# Altium schematic sheet OMODRI_ADC.SchDoc
size 431 x 279 mm; Date: Not shown in title block; ApprovedBy: Not shown in title block; CheckedBy: Not shown in title block; Author: Not shown in title block; CompanyName: Not shown in title block; DrawnBy: Cody Watkins; Engineer: Not shown in title block; Organization: Not shown in title block; Address1: Not shown in title block; Address2: Not shown in title block; Address3: Not shown in title block; Address4: Not shown in title block; DocumentNumber: 4; Revision: Use project parameter SCH_Rev; SheetNumber: 4; SheetTotal: 11; PageSetup: Record=PageOptions|CenterHorizontal=True|CenterVertical=True|PrintScale=1.00|XCorrection=1.00|YCorrection=1.00|PrintKind=0|BorderSize=5000000|LeftOffset=0|BottomOffset=0|Orientation=2|PaperLength=1000|PaperWidth=1000|Scale=100|PaperSource=15|PrintQuality=600|MediaType=1|DitherType=10|PaperKind=Letter|PrintScaleMode=1; CurrentTime: Not shown in title block; CurrentDate: Not shown in title block; Time: Not shown in title block; DocumentFullPathAndName: Not shown in title block; DocumentName: Not shown in title block; ModifiedDate: Not shown in title block; ImagePath: Not shown in title block
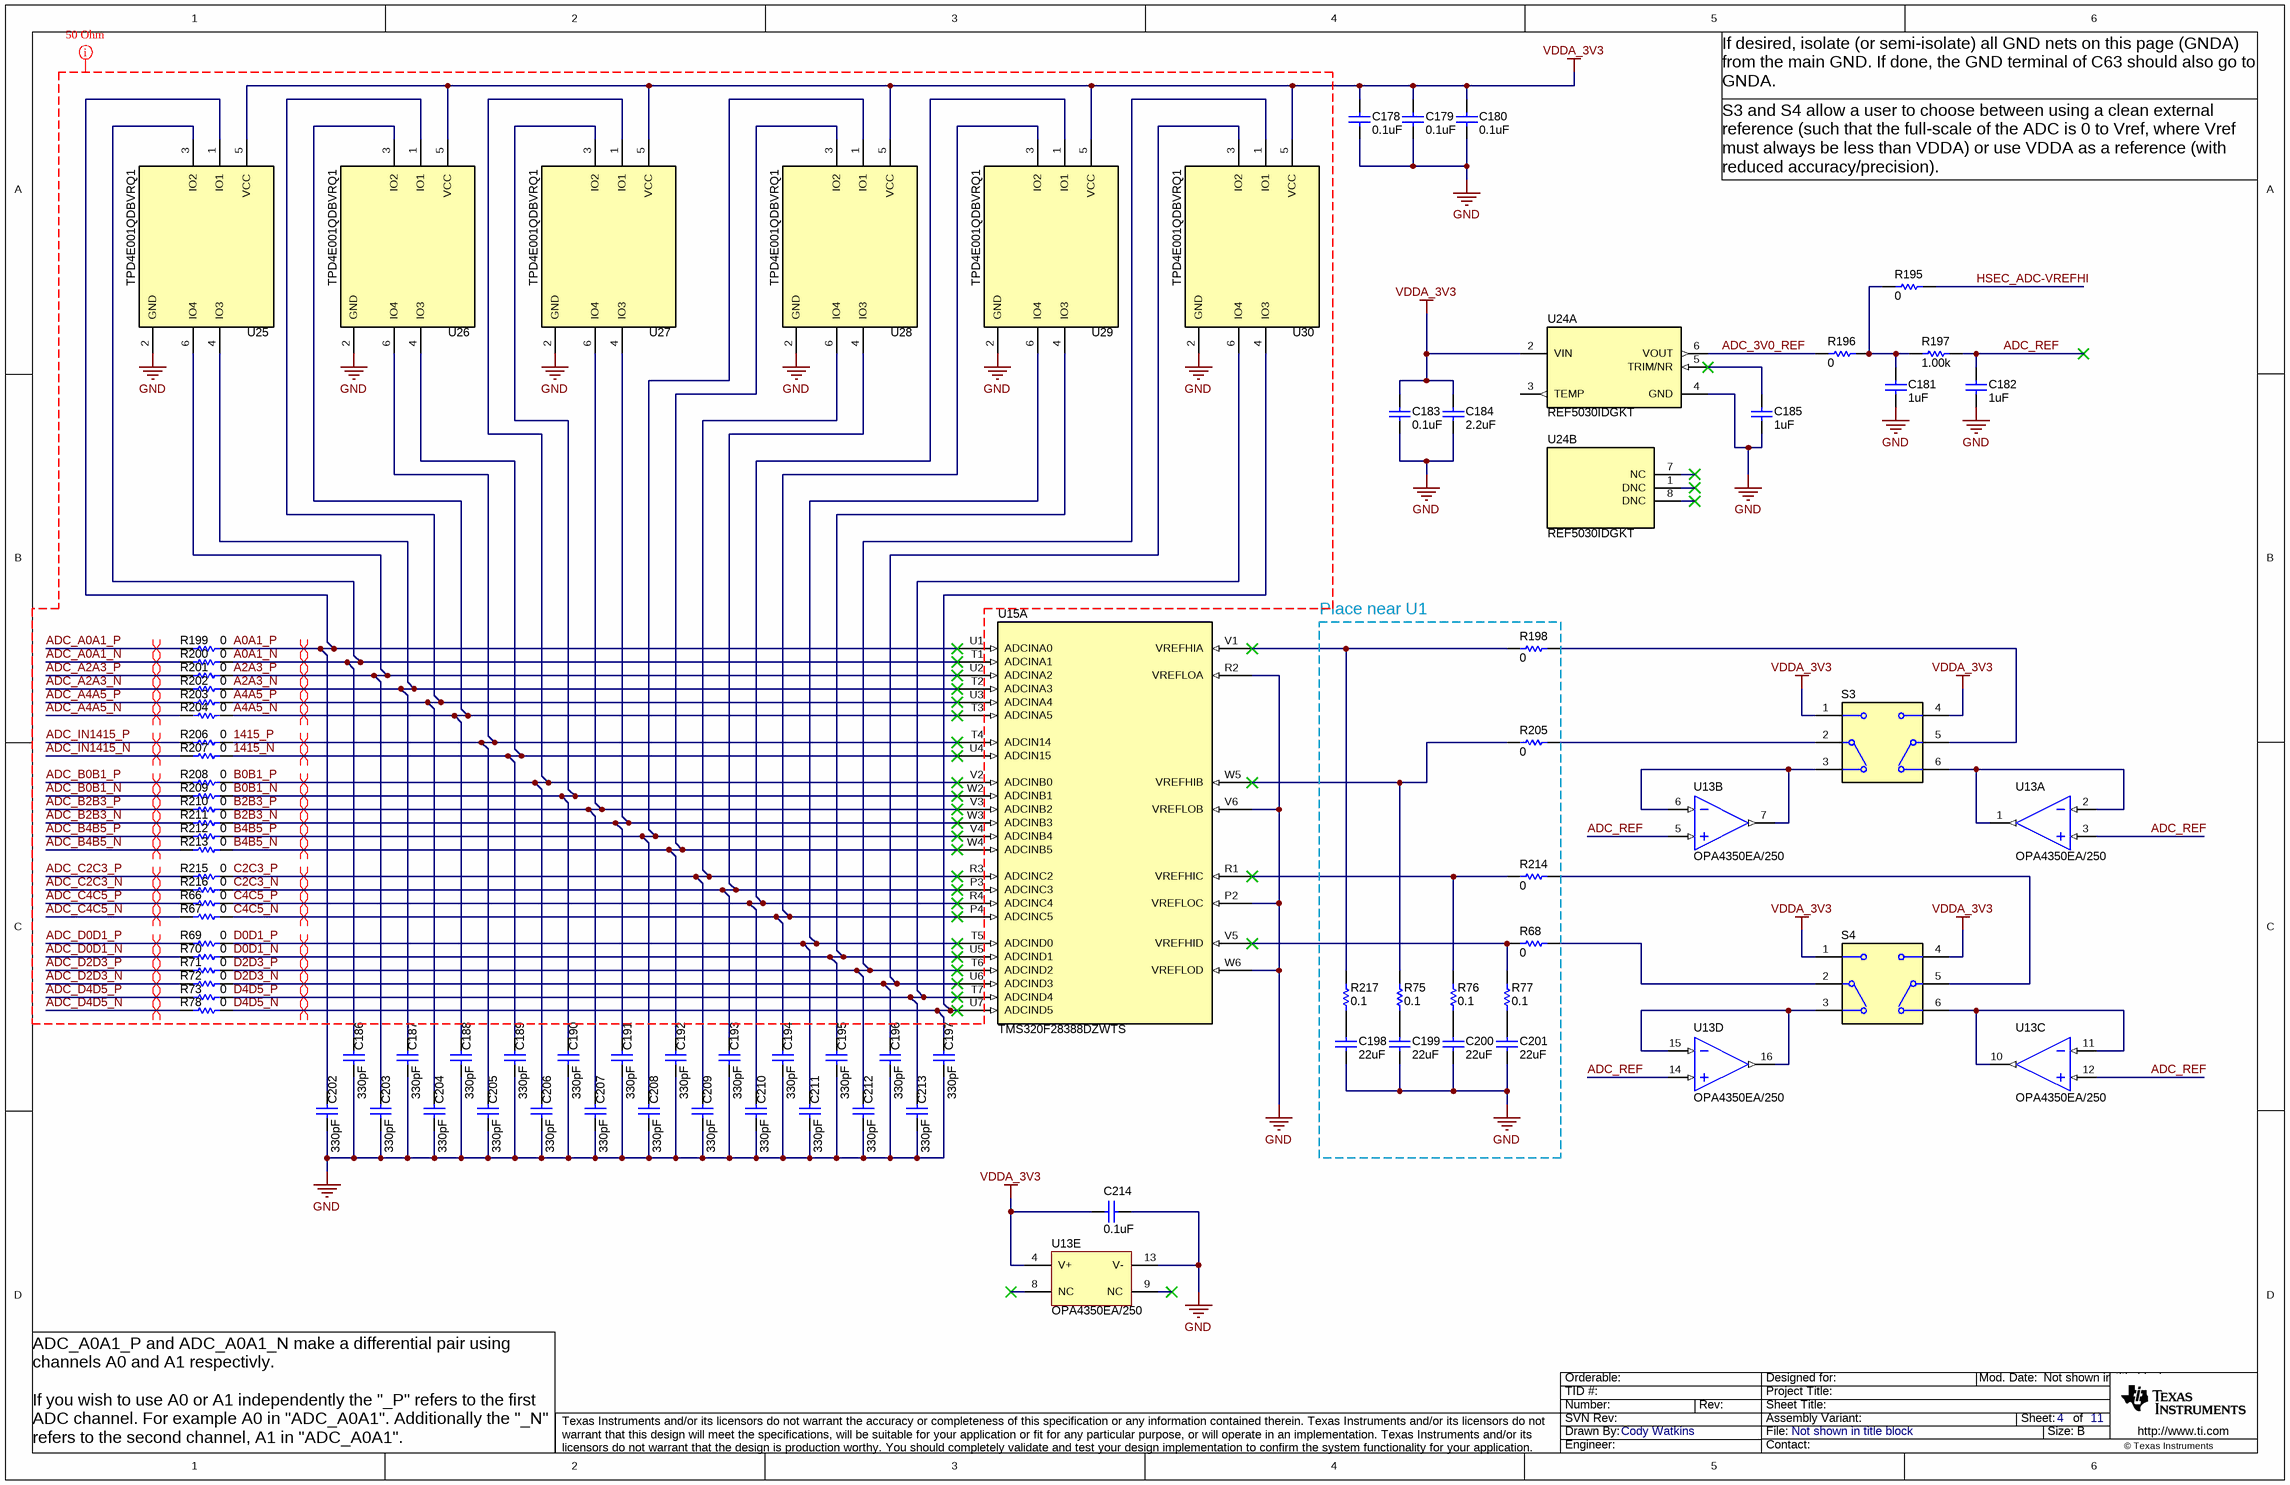
[diagram p0: OMODRI_ADC.SchDoc]

## Parts
C178  ValueDisplayed: 0.1uF  [0603]  (hidden comment: C0603C104K8RACTU)
C179  ValueDisplayed: 0.1uF  [0603]  (hidden comment: C0603C104K8RACTU)
C180  ValueDisplayed: 0.1uF  [0603]  (hidden comment: C0603C104K8RACTU)
C181  ValueDisplayed: 1uF  [0603]  (hidden comment: C0603C105Z9VACTU)
C182  ValueDisplayed: 1uF  [0603]  (hidden comment: C0603C105Z9VACTU)
C183  ValueDisplayed: 0.1uF  [0603]  (hidden comment: C0603C104K8RACTU)
C184  ValueDisplayed: 2.2uF  [0603]  (hidden comment: C0603C225K9PACTU)
C185  ValueDisplayed: 1uF  [0603]  (hidden comment: C0603C105Z9VACTU)
C186  ValueDisplayed: 330pF  [0603]  (hidden comment: C0603C331J5GACTU)
C187  ValueDisplayed: 330pF  [0603]  (hidden comment: C0603C331J5GACTU)
C188  ValueDisplayed: 330pF  [0603]  (hidden comment: C0603C331J5GACTU)
C189  ValueDisplayed: 330pF  [0603]  (hidden comment: C0603C331J5GACTU)
C190  ValueDisplayed: 330pF  [0603]  (hidden comment: C0603C331J5GACTU)
C191  ValueDisplayed: 330pF  [0603]  (hidden comment: C0603C331J5GACTU)
C192  ValueDisplayed: 330pF  [0603]  (hidden comment: C0603C331J5GACTU)
C193  ValueDisplayed: 330pF  [0603]  (hidden comment: C0603C331J5GACTU)
C194  ValueDisplayed: 330pF  [0603]  (hidden comment: C0603C331J5GACTU)
C195  ValueDisplayed: 330pF  [0603]  (hidden comment: C0603C331J5GACTU)
C196  ValueDisplayed: 330pF  [0603]  (hidden comment: C0603C331J5GACTU)
C197  ValueDisplayed: 330pF  [0603]  (hidden comment: C0603C331J5GACTU)
C198  ValueDisplayed: 22uF  [0603]  (hidden comment: GRM188R61A226ME15D)
C199  ValueDisplayed: 22uF  [0603]  (hidden comment: GRM188R61A226ME15D)
C200  ValueDisplayed: 22uF  [0603]  (hidden comment: GRM188R61A226ME15D)
C201  ValueDisplayed: 22uF  [0603]  (hidden comment: GRM188R61A226ME15D)
C202  ValueDisplayed: 330pF  [0603]  (hidden comment: C0603C331J5GACTU)
C203  ValueDisplayed: 330pF  [0603]  (hidden comment: C0603C331J5GACTU)
C204  ValueDisplayed: 330pF  [0603]  (hidden comment: C0603C331J5GACTU)
C205  ValueDisplayed: 330pF  [0603]  (hidden comment: C0603C331J5GACTU)
C206  ValueDisplayed: 330pF  [0603]  (hidden comment: C0603C331J5GACTU)
C207  ValueDisplayed: 330pF  [0603]  (hidden comment: C0603C331J5GACTU)
C208  ValueDisplayed: 330pF  [0603]  (hidden comment: C0603C331J5GACTU)
C209  ValueDisplayed: 330pF  [0603]  (hidden comment: C0603C331J5GACTU)
C210  ValueDisplayed: 330pF  [0603]  (hidden comment: C0603C331J5GACTU)
C211  ValueDisplayed: 330pF  [0603]  (hidden comment: C0603C331J5GACTU)
C212  ValueDisplayed: 330pF  [0603]  (hidden comment: C0603C331J5GACTU)
C213  ValueDisplayed: 330pF  [0603]  (hidden comment: C0603C331J5GACTU)
C214  ValueDisplayed: 0.1uF  [0603]  (hidden comment: C0603C104K8RACTU)
R66  ValueDisplayed: 0  [0603]  (hidden comment: CRCW06030000Z0EA)
R67  ValueDisplayed: 0  [0603]  (hidden comment: CRCW06030000Z0EA)
R68  ValueDisplayed: 0  [0603]  (hidden comment: CRCW06030000Z0EA)
R69  ValueDisplayed: 0  [0603]  (hidden comment: CRCW06030000Z0EA)
R70  ValueDisplayed: 0  [0603]  (hidden comment: CRCW06030000Z0EA)
R71  ValueDisplayed: 0  [0603]  (hidden comment: CRCW06030000Z0EA)
R72  ValueDisplayed: 0  [0603]  (hidden comment: CRCW06030000Z0EA)
R73  ValueDisplayed: 0  [0603]  (hidden comment: CRCW06030000Z0EA)
R75  ValueDisplayed: 0.1  [0402]  (hidden comment: ERJ2BWFR100X)
R76  ValueDisplayed: 0.1  [0402]  (hidden comment: ERJ2BWFR100X)
R77  ValueDisplayed: 0.1  [0402]  (hidden comment: ERJ2BWFR100X)
R78  ValueDisplayed: 0  [0603]  (hidden comment: CRCW06030000Z0EA)
R195  ValueDisplayed: 0  [0603]  (hidden comment: CRCW06030000Z0EA)
R196  ValueDisplayed: 0  [0603]  (hidden comment: CRCW06030000Z0EA)
R197  ValueDisplayed: 1.00k  [0603]  (hidden comment: RC0603FR-071KL)
R198  ValueDisplayed: 0  [0603]  (hidden comment: CRCW06030000Z0EA)
R199  ValueDisplayed: 0  [0603]  (hidden comment: CRCW06030000Z0EA)
R200  ValueDisplayed: 0  [0603]  (hidden comment: CRCW06030000Z0EA)
R201  ValueDisplayed: 0  [0603]  (hidden comment: CRCW06030000Z0EA)
R202  ValueDisplayed: 0  [0603]  (hidden comment: CRCW06030000Z0EA)
R203  ValueDisplayed: 0  [0603]  (hidden comment: CRCW06030000Z0EA)
R204  ValueDisplayed: 0  [0603]  (hidden comment: CRCW06030000Z0EA)
R205  ValueDisplayed: 0  [0603]  (hidden comment: CRCW06030000Z0EA)
R206  ValueDisplayed: 0  [0603]  (hidden comment: CRCW06030000Z0EA)
R207  ValueDisplayed: 0  [0603]  (hidden comment: CRCW06030000Z0EA)
R208  ValueDisplayed: 0  [0603]  (hidden comment: CRCW06030000Z0EA)
R209  ValueDisplayed: 0  [0603]  (hidden comment: CRCW06030000Z0EA)
R210  ValueDisplayed: 0  [0603]  (hidden comment: CRCW06030000Z0EA)
R211  ValueDisplayed: 0  [0603]  (hidden comment: CRCW06030000Z0EA)
R212  ValueDisplayed: 0  [0603]  (hidden comment: CRCW06030000Z0EA)
R213  ValueDisplayed: 0  [0603]  (hidden comment: CRCW06030000Z0EA)
R214  ValueDisplayed: 0  [0603]  (hidden comment: CRCW06030000Z0EA)
R215  ValueDisplayed: 0  [0603]  (hidden comment: CRCW06030000Z0EA)
R216  ValueDisplayed: 0  [0603]  (hidden comment: CRCW06030000Z0EA)
R217  ValueDisplayed: 0.1  [0402]  (hidden comment: ERJ2BWFR100X)
S3  CAS-D20TA  [SW_CAS-D20TA]  (value not drawn)
S4  CAS-D20TA  [SW_CAS-D20TA]  (value not drawn)
U13  OPA4350EA/250  [DBQ0016A_N]  (parts A,B,C,D,E of 5)
U15  TMS320F28388DZWTS  [ZWT0337A]  (part A of 5)
U24  REF5030IDGKT  [DGK0008A_N]  (parts A,B of 2)
U25  TPD4E001QDBVRQ1  [DBV0006A_N]
U26  TPD4E001QDBVRQ1  [DBV0006A_N]
U27  TPD4E001QDBVRQ1  [DBV0006A_N]
U28  TPD4E001QDBVRQ1  [DBV0006A_N]
U29  TPD4E001QDBVRQ1  [DBV0006A_N]
U30  TPD4E001QDBVRQ1  [DBV0006A_N]

## Nets
GND: C178.2 C179.2 C180.2 C181.2 C182.2 C183.2 C184.2 C185.2 C186.2 C187.2 C188.2 C189.2 C190.2 C191.2 C192.2 C193.2 C194.2 C195.2 C196.2 C197.2 C198.2 C199.2 C200.2 C201.2 C202.2 C203.2 C204.2 C205.2 C206.2 C207.2 C208.2 C209.2 C210.2 C211.2 C212.2 C213.2 C214.1 U13.13(V-) U15.P2(VREFLOC) U15.R2(VREFLOA) U15.V6(VREFLOB) U15.W6(VREFLOD) U24.4(GND) U25.2(GND) U26.2(GND) U27.2(GND) U28.2(GND) U29.2(GND) U30.2(GND)
VDDA_3V3: C178.1 C179.1 C180.1 C183.1 C184.1 C214.2 S3.1 S3.4 S4.1 S4.4 U13.4(V+) U24.2(VIN) U25.5(VCC) U26.5(VCC) U27.5(VCC) U28.5(VCC) U29.5(VCC) U30.5(VCC)
1415_N: C189.1 R207.1 U15.U4(ADCIN15) U26.4(IO3)
1415_P: C205.1 R206.1 U15.T4(ADCIN14) U26.6(IO4)
A0A1_N: C186.1 R200.1 U15.T1(ADCINA1) U25.3(IO2)
A0A1_P: C202.1 R199.1 U15.U1(ADCINA0) U25.1(IO1)
A2A3_N: C187.1 R202.1 U15.T2(ADCINA3) U25.4(IO3)
A2A3_P: C203.1 R201.1 U15.U2(ADCINA2) U25.6(IO4)
A4A5_N: C188.1 R204.1 U15.T3(ADCINA5) U26.3(IO2)
A4A5_P: C204.1 R203.1 U15.U3(ADCINA4) U26.1(IO1)
ADC_3V0_REF: R196.2 U24.6(VOUT)
ADC_A0A1_N: R200.2
ADC_A0A1_P: R199.2
ADC_A2A3_N: R202.2
ADC_A2A3_P: R201.2
ADC_A4A5_N: R204.2
ADC_A4A5_P: R203.2
ADC_B0B1_N: R209.2
ADC_B0B1_P: R208.2
ADC_B2B3_N: R211.2
ADC_B2B3_P: R210.2
ADC_B4B5_N: R213.2
ADC_B4B5_P: R212.2
ADC_C2C3_N: R216.2
ADC_C2C3_P: R215.2
ADC_C4C5_N: R67.2
ADC_C4C5_P: R66.2
ADC_D0D1_N: R70.2
ADC_D0D1_P: R69.2
ADC_D2D3_N: R72.2
ADC_D2D3_P: R71.2
ADC_D4D5_N: R78.2
ADC_D4D5_P: R73.2
ADC_IN1415_N: R207.2
ADC_IN1415_P: R206.2
ADC_REF: C182.1 R197.2 U13.3(IN_A+) U13.5(IN_B+) U13.12(IN_C+) U13.14(IN_D+)
B0B1_N: C190.1 R209.1 U15.W2(ADCINB1) U27.3(IO2)
B0B1_P: C206.1 R208.1 U15.V2(ADCINB0) U27.1(IO1)
B2B3_N: C191.1 R211.1 U15.W3(ADCINB3) U27.4(IO3)
B2B3_P: C207.1 R210.1 U15.V3(ADCINB2) U27.6(IO4)
B4B5_N: C192.1 R213.1 U15.W4(ADCINB5) U28.3(IO2)
B4B5_P: C208.1 R212.1 U15.V4(ADCINB4) U28.1(IO1)
C2C3_N: C193.1 R216.1 U15.P3(ADCINC3) U28.4(IO3)
C2C3_P: C209.1 R215.1 U15.R3(ADCINC2) U28.6(IO4)
C4C5_N: C194.1 R67.1 U15.P4(ADCINC5) U29.3(IO2)
C4C5_P: C210.1 R66.1 U15.R4(ADCINC4) U29.1(IO1)
D0D1_N: C195.1 R70.1 U15.U5(ADCIND1) U29.4(IO3)
D0D1_P: C211.1 R69.1 U15.T5(ADCIND0) U29.6(IO4)
D2D3_N: C196.1 R72.1 U15.U6(ADCIND3) U30.3(IO2)
D2D3_P: C212.1 R71.1 U15.T6(ADCIND2) U30.1(IO1)
D4D5_N: C197.1 R78.1 U15.U7(ADCIND5) U30.4(IO3)
D4D5_P: C213.1 R73.1 U15.T7(ADCIND4) U30.6(IO4)
HSEC_ADC-VREFHI: R195.1
NetC181_1: C181.1 R195.2 R196.1 R197.1
NetC185_1: C185.1 U24.5(TRIM/NR)
NetC198_1: C198.1 R217.2
NetC199_1: C199.1 R75.2
NetC200_1: C200.1 R76.2
NetC201_1: C201.1 R77.2
NetR68_1: R68.1 S4.2(C)
NetR68_2: R68.2 R77.1 U15.V5(VREFHID)
NetR75_1: R75.1 R205.2 U15.W5(VREFHIB)
NetR76_1: R76.1 R214.2 U15.R1(VREFHIC)
NetR198_1: R198.1 S3.5(C)
NetR198_2: R198.2 R217.1 U15.V1(VREFHIA)
NetR205_1: R205.1 S3.2(C)
NetR214_1: R214.1 S4.5(C)
NetS3_3: S3.3 U13.6(IN_B-) U13.7(OUT_B)
NetS3_6: S3.6 U13.1(OUT_A) U13.2(IN_A-)
NetS4_3: S4.3 U13.15(IN_D-) U13.16(OUT_D)
NetS4_6: S4.6 U13.10(OUT_C) U13.11(IN_C-)

Not connected (* = marked no-connect by the designer): U13 8(NC)* 9(NC)*; U24 1(DNC)* 3(TEMP) 7(NC)* 8(DNC)*

## Layout directives
differential pair: 1415_N, 1415_P, A0A1_N, A0A1_P, A2A3_N, A2A3_P, A4A5_N, A4A5_P, ADC_A0A1_N, ADC_A0A1_P, ADC_A2A3_N, ADC_A2A3_P, ADC_A4A5_N, ADC_A4A5_P, ADC_B0B1_N, ADC_B0B1_P, ADC_B2B3_N, ADC_B2B3_P, ADC_B4B5_N, ADC_B4B5_P, ADC_C2C3_N, ADC_C2C3_P, ADC_C4C5_N, ADC_C4C5_P, ADC_D0D1_N, ADC_D0D1_P, ADC_D2D3_N, ADC_D2D3_P, ADC_D4D5_N, ADC_D4D5_P, ADC_IN1415_N, ADC_IN1415_P, B0B1_N, B0B1_P, B2B3_N, B2B3_P, B4B5_N, B4B5_P, C2C3_N, C2C3_P, C4C5_N, C4C5_P, D0D1_N, D0D1_P, D2D3_N, D2D3_P, D4D5_N, D4D5_P
50 Ohm Impedance: Undefined: 1415_N, 1415_P, A0A1_N, A0A1_P, A2A3_N, A2A3_P, A4A5_N, A4A5_P, ADC_A0A1_N, ADC_A0A1_P, ADC_A2A3_N, ADC_A2A3_P, ADC_A4A5_N, ADC_A4A5_P, ADC_B0B1_N, ADC_B0B1_P, ADC_B2B3_N, ADC_B2B3_P, ADC_B4B5_N, ADC_B4B5_P, ADC_C2C3_N, ADC_C2C3_P, ADC_C4C5_N, ADC_C4C5_P, ADC_D0D1_N, ADC_D0D1_P, ADC_D2D3_N, ADC_D2D3_P, ADC_D4D5_N, ADC_D4D5_P, ADC_IN1415_N, ADC_IN1415_P, B0B1_N, B0B1_P, B2B3_N, B2B3_P, B4B5_N, B4B5_P, C2C3_N, C2C3_P, C4C5_N, C4C5_P, D0D1_N, D0D1_P, D2D3_N, D2D3_P, D4D5_N, D4D5_P, GND

## Notes on the sheet
- If desired, isolate (or semi-isolate) all GND nets on this page (GNDA) from the main GND. If done, the GND terminal of C63 should also go to GNDA.
- S3 and S4 allow a user to choose between using a clean external reference (such that the full-scale of the ADC is 0 to Vref, where Vref must always be less than VDDA) or use VDDA as a reference (with reduced accuracy/precision).
- Place near U1
- ADC_A0A1_P and ADC_A0A1_N make a differential pair using channels A0 and A1 respectivly.
  If you wish to use A0 or A1 independently the "_P" refers to the first ADC channel. For example A0 in "ADC_A0A1". Additionally the "_N" refers to the second channel, A1 in "ADC_A0A1".
- Drawn By:
- SVN Rev:
- Number:
- TID #:
- Orderable:
- Rev:
- Sheet Title:
- File:
- Project Title:
- Designed for:
- Assembly Variant:
- Mod. Date:
- Sheet:
- Size:
- of
- B
- http://www.ti.com
- Texas Instruments and/or its licensors do not warrant the accuracy or completeness of this specification or any information contained therein. Texas Instruments and/or its licensors do not warrant that this design will meet the specifications, will be suitable for your application or fit for any particular purpose, or will operate in an implementation. Texas Instruments and/or its licensors do not warrant that the design is production worthy. You should completely validate and test your design implementation to confirm the system functionality for your application.
- Engineer:
- Contact:
- © Texas Instruments

## Library data of the parts
C178-C180 C183 C214 = CMP-0006862-5: CAP, CERM, 0.1 uF, 10 V, +/- 10%, X7R, 0603; Manufacturer: Kemet; TaMin_C: -55°C; Polarized: N; SizeAreaWB_mm2: 4.68; Value1: Unknown; U/M: EA; Value: 0.1uF; TaMax_C: 125°C; SizeZ_mm: 1; SizeX_mm: 1.6; SizeY_mm: 0.8; Value2: 10V; SizeArea_mm2: 1.28; Cap_F: 100nF; AEC Category: Q200; Supplier Part Number 2: 80-C0603C104K8R; Publisher: Texas Instruments; Supplier 2: Mouser; Supplier Part Number 3: 1640032; TempCo: X7R; Supplier 3: Farnell; Published: 2008-06-19; RoHS: Y; MountType: SMT; Supplier 1: Digi-Key; PackageReference: 0603; Tolerance_%: 10%; Cap_Case: 0603; CompType: Capacitor; LatestRevisionDate: 2017-03-09; PartNumber: C0603C104K8RACTU; AEC Qualified: ?; ComponentLink1Description: Datasheet link; Supplier Part Number 1: 399-1095-1-ND; Technology: Ceramic; ComponentLink1URL: http://www.kemet.com/kemet/web/homepage/kechome.nsf/vapubfiles/F3102_Y5V.pdf/$file/F3102_Y5V.pdf
C181 C182 C185 = CMP-0006871-4: CAP, CERM, 1 uF, 6.3 V, +80/-20%, Y5V, 0603; Manufacturer: Kemet; TaMin_C: -30°C; Polarized: N; SizeAreaWB_mm2: 4.68; Value1: Unknown; U/M: EA; Value: 1uF; TaMax_C: 85°C; Tolerance_%: 80%; SizeZ_mm: 1; SizeX_mm: 1.6; SizeY_mm: 0.8; Value2: 6.3V; SizeArea_mm2: 1.28; Cap_F: 1µF; AEC Category: Q200; Supplier Part Number 2: 80-C0603C105Z9V; Publisher: Texas Instruments; Supplier 2: Mouser; Supplier Part Number 3: 1515067; TempCo: Y5V; Supplier 3: Farnell; Published: 2008-06-19; RoHS: Y; MountType: SMT; Supplier 1: Digi-Key; PackageReference: 0603; Cap_Case: 0603; CompType: Capacitor; LatestRevisionDate: 2017-03-09; PartNumber: C0603C105Z9VACTU; AEC Qualified: ?; ComponentLink1Description: Datasheet link; Supplier Part Number 1: 399-3217-1-ND; Technology: Ceramic; ComponentLink1URL: http://www.kemet.com/kemet/web/homepage/kechome.nsf/vapubfiles/F3102_Y5V.pdf/$file/F3102_Y5V.pdf
C184 = CMP-0006907-5: CAP, CERM, 2.2 uF, 6.3 V, +/- 10%, X5R, 0603; Manufacturer: Kemet; TaMin_C: -55°C; Polarized: N; SizeAreaWB_mm2: 4.68; Value1: Unknown; U/M: EA; Value: 2.2uF; TaMax_C: 85°C; SizeZ_mm: 1; SizeX_mm: 1.6; SizeY_mm: 0.8; Value2: 6.3V; SizeArea_mm2: 1.28; Cap_F: 2.2µF; AEC Category: Q200; Supplier Part Number 2: 80-C0603C225K9P; Publisher: Texas Instruments; Supplier 2: Mouser; Supplier Part Number 3: 1288257; TempCo: X5R; Supplier 3: Farnell; Published: 2008-06-19; RoHS: Y; MountType: SMT; Supplier 1: Digi-Key; PackageReference: 0603; Tolerance_%: 10%; Cap_Case: 0603; CompType: Capacitor; LatestRevisionDate: 2017-03-09; PartNumber: C0603C225K9PACTU; AEC Qualified: ?; ComponentLink1Description: Datasheet link; Supplier Part Number 1: 399-3362-1-ND; Technology: Ceramic; ComponentLink1URL: http://www.kemet.com/kemet/web/homepage/kechome.nsf/vapubfiles/F3102_Y5V.pdf/$file/F3102_Y5V.pdf
C186-C197 C202-C213 = CMP-0006920-4: CAP, CERM, 330 pF, 50 V, +/- 5%, C0G/NP0, 0603; Manufacturer: Kemet; TaMin_C: -55°C; Polarized: N; SizeAreaWB_mm2: 4.68; Value1: Unknown; U/M: EA; Value: 330pF; TaMax_C: 125°C; SizeZ_mm: 1; SizeX_mm: 1.6; SizeY_mm: 0.8; Value2: 50V; SizeArea_mm2: 1.28; AEC Category: Q200; Supplier Part Number 2: 80-C0603C331J5G; Publisher: Texas Instruments; Supplier 2: Mouser; Supplier Part Number 3: 1414634; TempCo: C0G/NP0; Supplier 3: Farnell; Published: 2008-06-19; RoHS: Y; MountType: SMT; Supplier 1: Digi-Key; PackageReference: 0603; Tolerance_%: 5%; Cap_Case: 0603; CompType: Capacitor; LatestRevisionDate: 2017-03-09; PartNumber: C0603C331J5GACTU; AEC Qualified: ?; Cap_F: 330pF; ComponentLink1Description: Datasheet link; Supplier Part Number 1: 399-1068-1-ND; Technology: Ceramic; ComponentLink1URL: http://www.kemet.com/kemet/web/homepage/kechome.nsf/vapubfiles/F3102_Y5V.pdf/$file/F3102_Y5V.pdf
C198-C201 = CMP-0007324-5: CAP, CERM, 22 uF, 10 V, +/- 20%, X5R, 0603; Manufacturer: MuRata; TaMin_C: -55°C; Polarized: N; SizeAreaWB_mm2: 4.68; Value1: Unknown; U/M: EA; Value: 22uF; TaMax_C: 85°C; SizeZ_mm: 1; SizeX_mm: 1.6; SizeY_mm: 0.8; Value2: 10V; SizeArea_mm2: 1.28; Cap_F: 22µF; AEC Category: Q200; Supplier Part Number 2: 68X2786; Publisher: Texas Instruments; Supplier 2: Newark; Supplier Part Number 3: 81-GRM188R61A226ME5D; TempCo: X5R; Supplier 3: Mouser; Published: 2008-06-19; RoHS: Y; MountType: SMT; Supplier 1: Digi-Key; PackageReference: 0603; Tolerance_%: 20%; Cap_Case: 0603; CompType: Capacitor; LatestRevisionDate: 2017-03-09; PartNumber: GRM188R61A226ME15D; AEC Qualified: ?; ComponentLink1Description: Datasheet link; Supplier Part Number 1: 490-10476-1-ND; Technology: Ceramic; ComponentLink1URL: http://psearch.murata.com/capacitor/product/GRM188R61A226ME15%23.pdf
R66-R73 R78 R195 R196 R198-R216 = CMP-0025697-4: RES, 0, 5%, 0.1 W, AEC-Q200 Grade 0, 0603; Manufacturer: Vishay-Dale; Value: 0; Value_Code: 0000; Power_W: 100mW; Value2: 0.1W; VDC_V: 75V; TempCo: 200 ppm/C; EIA_Code: E24; AEC Category: Q200; AEC Qualified: Y; SizeArea_mm2: 1.28; SizeX_mm: 1.6; SizeY_mm: 0.8; SizeZ_mm: 1; CompType: Resistor; PartNumber: CRCW06030000Z0EA; PackageReference: 0603; RoHS: E; Res_ohm: 0; Tolerance_%: 5%; Value1: 5%; MountType: SMT; Technology: Thick Film; ComponentLink1Description: Datasheet link; ComponentLink1URL: http://www.vishay.com/docs/20035/dcrcwe3.pdf; Supplier 1: Digi-Key; Supplier Part Number 1: 541-0.0GCT-ND; Supplier 2: Newark; Supplier Part Number 2: 52K8014; Supplier 3: Mouser; Supplier Part Number 3: 71-CRCW0603-0-E3; AEC Grade: 0
R75-R77 R217 = CMP-0078660-1: RES, 0.1, 1%, 0.25 W, 0402; Manufacturer: Panasonic; Power_W: 250mW; TempCo: 300 ppm/C; Value_Code: R100; Value: 0.1; EIA_Code: E96; Res_ohm: 1d; SizeX_mm: 1; SizeY_mm: 0.5; SizeZ_mm: 0.6; Value2: 0.25W; AEC Qualified: N; AEC Category: Q200; ComponentLink1URL: https://industrial.panasonic.com/cdbs/www-data/pdf/RDN0000/AOA0000C313.pdf; Supplier Part Number 2: 667-ERJ-2BWFR100X; Supplier 2: Mouser; RoHS: Y; Value1: 1%; MountType: SMT; Supplier 1: Digi-Key; PackageReference: 0402; Tolerance_%: 1%; SizeArea_mm2: 0.5; CompType: Resistor; PartNumber: ERJ2BWFR100X; ComponentLink1Description: Datasheet link; AEC Grade: N/A; Supplier Part Number 1: P17368CT-ND; Technology: Thick Film
R197 = CMP-0022895-5: RES, 1.00 k, 1%, 0.1 W, 0603; Manufacturer: Yageo; Power_W: 100mW; TempCo: 100 ppm/C; Value_Code: 1k00; Value: 1.00k; EIA_Code: E96; Res_ohm: 1k; SizeX_mm: 1.6; SizeY_mm: 0.8; SizeZ_mm: 1; Value2: 0.1W; SizeArea_mm2: 1.28; AEC Qualified: N; VDC_V: 75V; AEC Category: Q200; SizeAreaWB_mm2: 4.68; Supplier Part Number 2: 603-RC0603FR-071KL; Supplier 2: Mouser; Supplier Part Number 3: 9238484; Supplier 3: Farnell; RoHS: Y; Value1: 1%; MountType: SMT; Supplier 1: Digi-Key; PackageReference: 0603; Tolerance_%: 1%; CompType: Resistor; PartNumber: RC0603FR-071KL; ComponentLink1Description: Datasheet link; Supplier Part Number 1: 311-1.00KHRCT-ND; Technology: Thick Film; ComponentLink1URL: http://www.yageo.com/pdf/Pu-RC0603_51_PbFree_L_2.pdf; AEC Grade: N/A
S3 S4 = CMP-0002233-1: Switch, Dual SPDT,  2 Pos, 0.1A, 6VDC, SMD; Manufacturer: Copal Electronics; CurrentRating_mA: 100A; SwitchFunction: On-On; VDC_V: 6V; PositionCount: 2; ComponentLink1Description: Datasheet Link; LatestRevisionDate: 2017-03-09; PackageReference: 5.4x3.9mm; Publisher: Texas Instruments; Supplier 1: Digi-Key; ComponentLink1URL: http://www.nidec-copal-electronics.com/e/catalog/switch/cas.pdf; Supplier Part Number 1: CASD20JCT-ND; MountType: SMT; Circuit: SPDT; Orientation: Top Actuated; PartNumber: CAS-D20TA; CompType: Switch; RoHS: Y
U13 = CMP-0041147-1: High-Speed, Single-Supply, Rail-to-Rail Operational Amplifier MicroAmplifier(TM) Series, 2.7 to 5.5 V, -55 to 150 degC, 16-pin SOP (DBQ16), Green (RoHS & no Sb/Br); Manufacturer: Texas Instruments; Number of Channels: 4; Vio (25C)(Max)(mV): 0.5; Total Supply Voltage(Min)(+5V is 5, +/-5V is 10): 2.7; Slew Rate(Typ)(V/us): 22; Total Supply Voltage(Max)(+5V is 5, +/-5V is 10): 5.5; Iq per channel(Max)(mA): 7.5; Vn at 1kHz(Typ)(nV/rtHz): 18; Sub Family: Low Input Bias Current Amp (<=10pA), Low Offset Voltage Amplifier (<=500uV), Low Supply Voltage Amplifier (<=2.7V), Precision Amplifier; IIB(Max)(pA): 10; CMRR(Min)(dB): 66; Mounting Technology: Surface Mount; ComponentLink3URL: http://www.ti.com/litv/pdf/msoi004g; ComponentLink1URL: http://www.ti.com/; PackageDescription: 16-Pin, Plastic Small Outline, Body 3.9 x 4.9 mm, Pitch 0.635 mm; Eco-Plan: Green (RoHS & no Sb/Br); ComponentLink1Description: Manufacturer URL; ComponentLink2URL: http://www.ti.com/general/docs/lit/getliterature.tsp?genericPartNumber=OPA4350&fileType=pdf; PackageVersion: 4073301-2/H, 10/2008; Code_JEDEC: MO-137; Offset Drift(Typ)(uV/C): 4; ComponentLink3Description: Package Specification; ComponentLink2Description: Datasheet; DatasheetVersion: SBOS099C; PartNumber: OPA4350EA/250; PackageReference: DBQ0016A
U15 = CMP-0081777-3: TMS320F28388DZWTS, ZWT0337A (NFBGA-337); Manufacturer: Texas Instruments; SizeAreaWB_mm2: 324; SizeArea_mm2: 256; AEC Qualified: N; AEC Category: Q200; SizeZ_mm: 1.4; SizeY_mm: 16; CompType: IC; ComponentLink1Description: Datasheet Link; ComponentLink2Description: Product Folder; PackageReference: ZWT0337A; PartNumber: TMS320F28388DZWTS; PackageDescription: NFBGA-337; ComponentLink2URL: http://www.ti.com/product/tms320f28388d; Alternate Manufacturer: Texas Instruments; ComponentLink3URL: http://www.ti.com/product/tms320f28388d/datasheet; ComponentLink1URL: http://www.ti.com/lit/ds/symlink/tms320f28388d.pdf; MountType: SMT; ComponentLink3Description: Online Datasheet; SizeX_mm: 16
U24 = CMP-0032596-2: Low Noise, Very Low Drift, Precision Series Voltage Reference, DGK0008A (VSSOP-8); Manufacturer: Texas Instruments; Temp Coeff(Max)(ppm/ degree C): 3; Iout/Iz(Max)(mA): 10; VI(Min)(V): 3.2; Eco-Plan: Green (RoHS & no Sb/Br); Initial Accuracy @ 25/deg C(%): 0.05; Iq(Max)(uA): 1000; VI(Max)(V): 18; Rating: Catalog; AEC Category: Q200; AEC Qualified: N; CompType: IC; SizeAreaWB_mm2: 23.6; SizeArea_mm2: 14.7; SizeX_mm: 4.9; SizeZ_mm: 1.1; PackageDescription: VSSOP-8; ComponentLink3URL: http://www.ti.com/product/ref5030/datasheet; PackageVersion: 4073329/E; DatasheetVersion: SBOS410E; VO(V): 3; PartNumber: REF5030IDGKT; ComponentLink3Description: Online Datasheet; ComponentLink2URL: http://www.ti.com/product/ref5030; ComponentLink1Description: Datasheet Link; Code_JEDEC: MO-187-AA; PackageReference: DGK0008A; SubFamily: Series Voltage Reference; ComponentLink1URL: http://www.ti.com/lit/ds/symlink/ref5030.pdf; ComponentLink2Description: Product Folder; MountType: SMT; RoHS: Y; SizeY_mm: 3
U25-U30 = CMP-0066599-1: Automotive Low-Capacitance 4-Channel +/-15-kV ESD Protection Array for High-Speed Data Interfaces, DBV0006A (SOT-23-6); Alternate Manufacturer: Texas Instruments; SizeAreaWB_mm2: 14.82; U/M: EA; SizeZ_mm: 1.45; SizeX_mm: 2.8; SizeY_mm: 2.9; SizeArea_mm2: 8.12; CompType: IC; ComponentLink1URL: http://www.ti.com/lit/ds/symlink/tpd4e001-q1.pdf; Publisher: Texas Instruments; PackageDescription: SOT-23-6; RoHS: Y; Footprint Path 6: C:\AltiumLibraries\Footprints\TI\.PcbLib; MountType: SMT; Manufacturer: Texas Instruments; PackageReference: DBV0006A; LatestRevisionDate: 2017-06-09; PartNumber: TPD4E001QDBVRQ1; ComponentLink1Description: Datasheet Link